# EAGLE design Puzzle PIR motion sensor v1.0 (EAGLE 5.10)
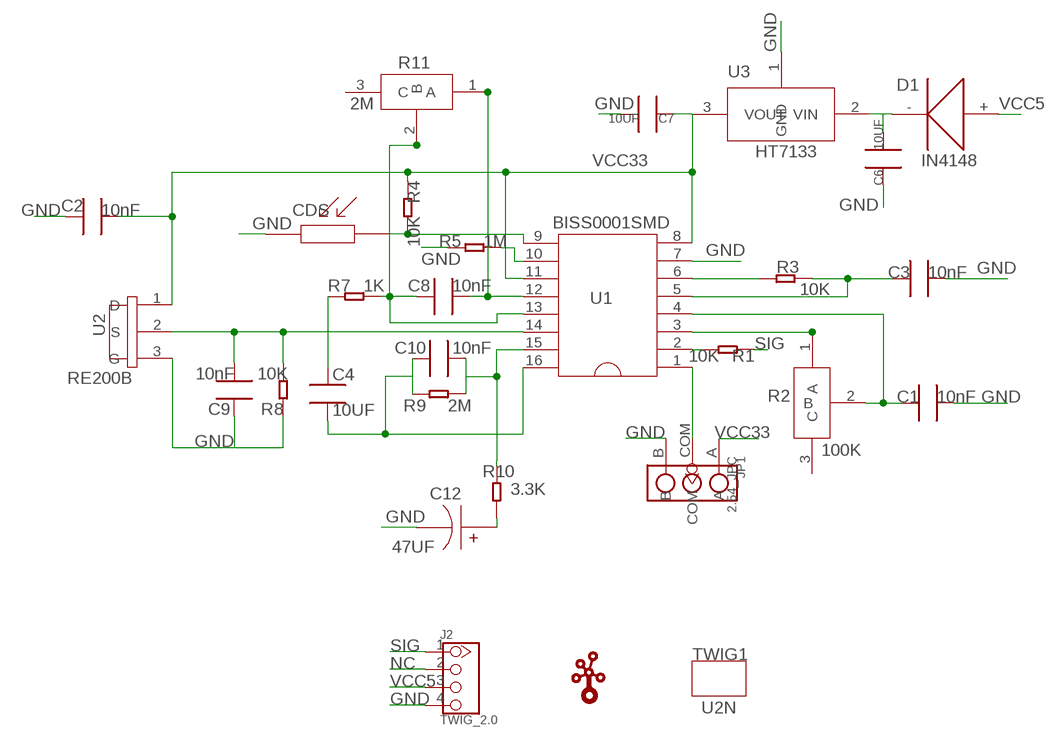
[diagram p0: schematic, sheet 1]

## Parts
C1  10nF  C0603  [0603]
C2  10nF  C0603  [0603]
C3  10nF  C0603  [0603]
C4  10UF  C0805  [0805]
C6  10UF  C0805  [0805]
C7  10UF  C0805  [0805]
C8  10nF  C0603  [0603]
C9  10nF  C0603  [0603]
C10  10nF  C0603  [0603]
C12  47UF  C_TAN1206  [C_TAN1206]
CDS  CDS  [CDS]
D1  IN4148  DIODE1206  [DIODE1206]
J2  TWIG_2.0  [2.0_1X4]
JP1  2.54_JPC  [2.54_JP_C]
R1  10K  R0603  [0603]
R2  100K  R_REG  [R_REG]
R3  10K  R0603  [0603]
R4  10K  R0603  [0603]
R5  1M  R0603  [0603]
R7  1K  R0603  [0603]
R8  10K  R0603  [0603]
R9  2M  R0603  [0603]
R10  3.3K  R0603  [0603]
R11  2M  R_REG  [R_REG]
TWIG1  U2N  [U2N]
U1  BISS0001SMD  [SOP16]
U2  RE200B  [RE200B]
U3  HT7133  [SOT89]
U$1  TWIGLOGOTWIGLOGO_SMALL  [TWIGLOGO_SMALL]

## Nets
GND: C1.2 C2.1 C3.2 C6.1 C7.2 C9.1 C12.2 CDS.1 J2.4 JP1.B R5.1 R8.1 U1.7 U2.3(G) U3.1(GND)
N$1: R2.1(A) U1.3
N$2: C1.1 R2.2(B) U1.4
N$3: C6.2 D1.- U3.2(VIN)
N$4: JP1.COM U1.1
N$5: R1.2 U1.2
N$6: R3.2 U1.6
N$7: C3.1 R3.1 U1.5
N$8: CDS.2 R4.2 U1.9
N$9: R5.2 U1.10
N$10: C9.2 R8.2 U1.14 U2.2(S)
N$11: C8.2 R11.1(A) U1.12
N$12: C8.1 R7.2 R11.2(B) U1.13
N$13: C4.2 C10.1 R9.1 U1.16
N$14: C10.2 R9.2 R10.2 U1.15
N$15: C4.1 R7.1
N$17: C12.1 R10.1
NC: J2.2
SIG: J2.1 R1.1
VCC5: D1.+ J2.3
VCC33: C2.2 C7.1 JP1.A R4.1 U1.8 U1.11 U2.1(D) U3.3(VOUT)
Unconnected: R2.3(C) R11.3(C)

## Library data of the parts
C1-C3 C8-C10 = CPT_SMD:C0603; C0603: 100N
C4 C6 C7 = CPT_SMD:C0805
C12 = seeedleo:C_TAN1206
CDS = seeedleo:CDS
D1 = CPT_SMD:DIODE
J2 = CONNECTER:TWIG_2.0
JP1 = CPT_CJ:2.54_JP
R1 R3-R5 R7-R10 = CPT_SMD:R0603
R2 R11 = seeedleo:R_REG
TWIG1 = twig_template1:U2N
U1 = seeedleo:BISS0001SMD
U2 = seeedleo:RE200B
U3 = seeedleo:HT7133
U$1 = seeedleo:TWIGLOGO

## Board
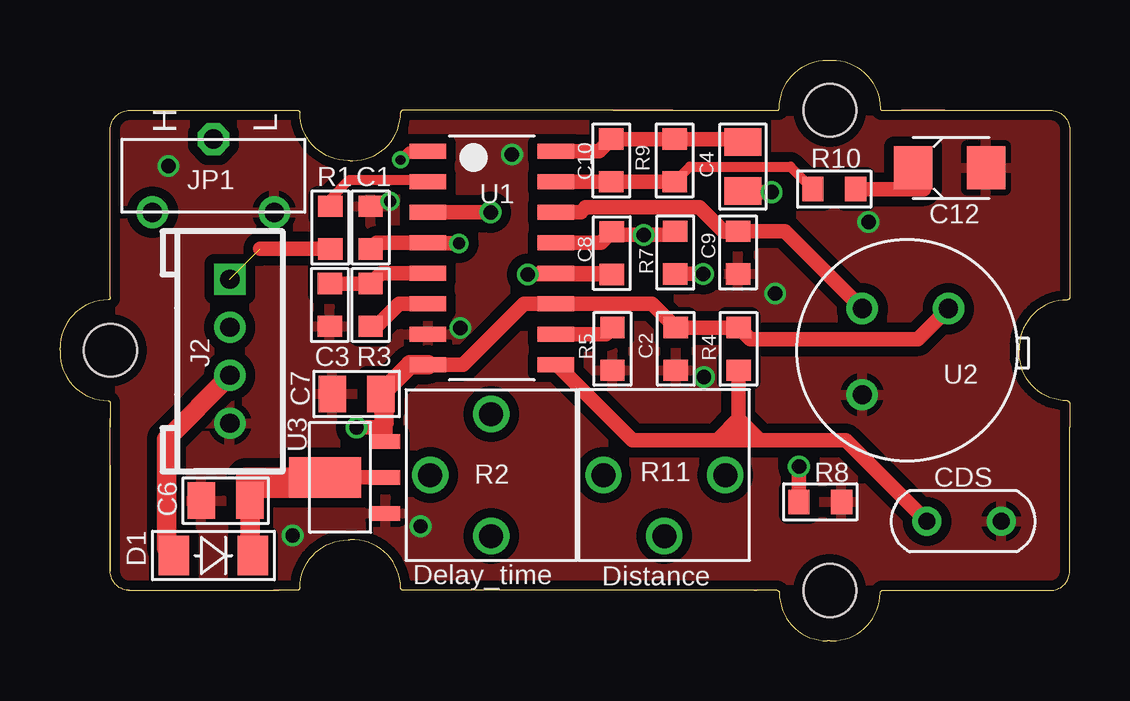
[diagram p1: board, top side]
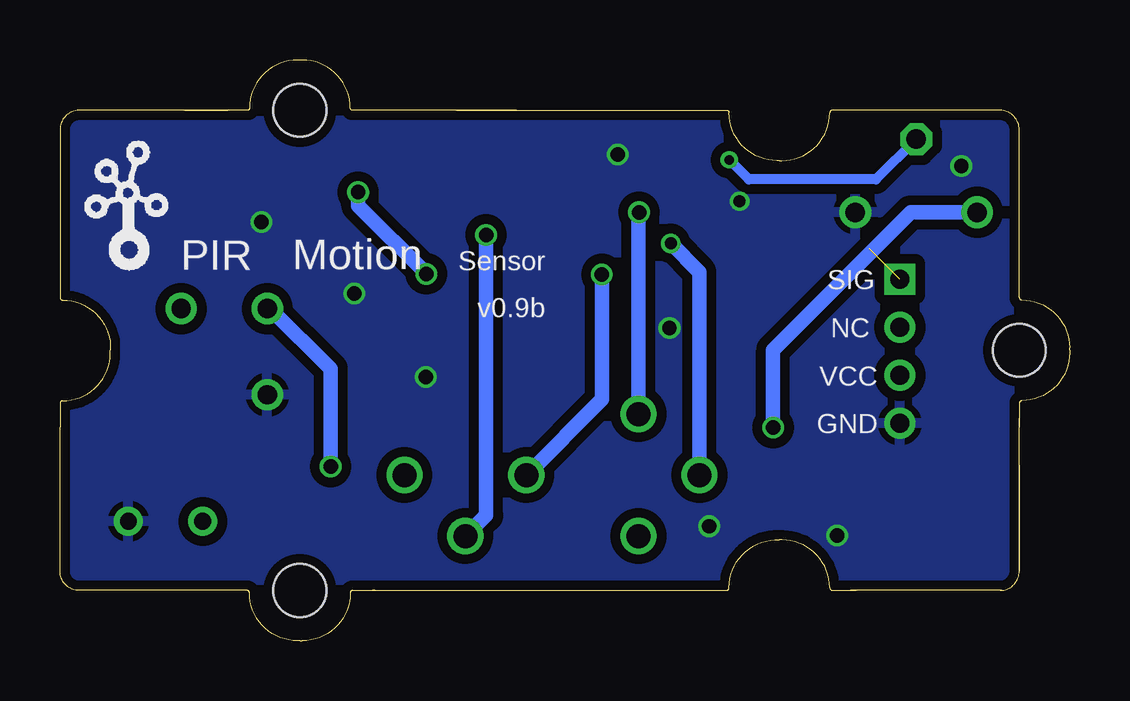
[diagram p2: board, bottom side, seen from below]

Size 42.09 x 24.2 mm. Coordinates in mm from the lower left corner, seen from the top.
Copper layers (1*16): Top 0.035mm / dielectric 1.5mm / Bottom 0.035mm
Design rules "SeeedStudio_rule_no_angle_090911": minimum track width 6mil, minimum drill 12mil, track to track 6mil, track to pad 6mil, pad to pad 6mil, via to via 6mil, smd to smd 0mil, copper to edge 10mil, drill to drill 10mil, minimum pad ring 10mil, minimum via ring 6mil, stop-mask expansion 2mil, vias tented up to drill 100mil, thermal gap 10mil

### Footprints (pad centres in the part's own frame; a part is rotated, then mirrored left to right if it is on the bottom)
0603 = smd 0.889 x 1.016: 1 -0.889,0; 2 0.889,0
0805 = smd 1.143 x 1.524: 1 -1.016,0; 2 1.016,0
C_TAN1206 = smd 1.6 x 1.8: 1 -1.27,0; 2 1.778,0
CDS = drill 0.7 round: 1 0,0; 2 3.1,0
DIODE1206 = smd 1.27 x 1.651: + -1.651,0; - 1.651,0
2.0_1X4 = drill 0.8 pad 1.27 square: 1 -3,0 | drill 0.8 pad 1.27 round: 2 -1,0; 3 1,0; 4 3,0
2.54_JP_C = drill 0.813 round: A -1.27,2.54; B -1.27,-2.54 | drill 0.813 octagon: COM 1.778,0
R_REG = drill 1 round: 1 0,0; 2 2.54,-2.54; 3 5.08,0
U2N = hole 2.2: 10.453,-10.42; 10.453,9.58; -19.535,-0.415
SOP16 = smd 0.635 x 1.524: 1 0,0; 2 1.27,0; 3 2.54,0; 4 3.81,0; 5 5.08,0; 6 6.35,0; 7 7.62,0; 8 8.89,0; 9 8.89,5.334; 10 7.62,5.334; 11 6.35,5.334; 12 5.08,5.334; 13 3.81,5.334; 14 2.54,5.334; 15 1.27,5.334; 16 0,5.334
RE200B = drill 0.8 round: 1 1.838,1.856; 2 -1.754,1.856; 3 -1.754,-1.736
SOT89 = smd 0.6 x 1.2: 1 -1.5,0; 2 0,0; 3 1.5,0 | smd 1.7 x 3: P$4 0,2.54

### Placement (x,y rotation side)
C1  12.95,17.22 90 top
C2  25.67,12.16 90 top
C3  11.25,13.99 270 top
C4  28.47,19.76 90 top
C6  6.9,5.84 0 top
C7  12.36,10.28 180 top
C8  23.01,16.15 270 top
C9  28.26,16.18 90 top
C10  22.98,20.01 270 top
C12  36.82,19.71 0 top
CDS  39.24,4.98 180 top
D1  6.4,3.55 0 top
J2  7.08,12.06 270 top
JP1  6.4,19.12 90 top
R1  11.27,17.22 90 top
R2  17.98,9.45 270 top
R3  12.95,13.99 270 top
R4  28.29,12.16 270 top
R5  23.03,12.16 90 top
R7  25.65,16.18 90 top
R8  31.69,5.79 180 top
R9  25.62,20.01 270 top
R10  32.28,18.82 180 top
R11  22.65,6.91 0 top
TWIG1  21.64,12.52 0 top
U1  15.34,20.39 270 top
U2  35.2,11.99 0 top
U3  13.58,6.8 90 top
U$1  41.45,15.31 0 bottom

### Tracks (layer width: path | path; a pad name or v marks a point on that pad's centre or on a via)
GND  (via drill 0.5, 0.6)
  Top 0.406: v13.76,18.31 13.15,18.31 C1.2
  other vias: 16.68,13.03 9.7,4.39 26.84,11 15.03,4.77 33.7,17.45 29.81,14.48 18.84,20.27 4.52,19.78
  pour Bottom (isolate 0.406): -1.48,24.84 43.99,24.84 43.99,-1.07 -1.48,-1.07
  pour Top (isolate 0.406): -1.48,24.84 44.11,24.84 44.11,-1.32 -1.48,-1.32
N$1  (via drill 0.6)
  Top 0.61: v17.95,17.85 U1.3
  Bottom 0.61: R2.1 17.98,17.83 v17.95,17.85
N$2  (via drill 0.5)
  Top 0.61: 13.1,16.18 C1.1 13.2,16.58 U1.4 15.36,16.56 v16.63,16.56
  Bottom 0.61: R2.2 15.44,15.37 v16.63,16.56
N$3
  Top 0.61: 10.87,6.81 U3.2
  Top 0.813: D1.- 7.92,3.55 C6.2 7.74,6.02 7.74,6.81 10.87,6.81
N$4  (via drill 0.41)
  Top 0.406: U1.1 14.55,20.39 v14.19,20.04
  Bottom 0.406: v14.19,20.04 13.38,19.23 8.07,19.23 JP1.COM
N$5
  Top 0.406: R1.2 11.27,18.41 12.06,19.2 15.26,19.2 U1.2
N$6
  Top 0.61: U1.6 14.14,14.04 13.2,13.1 R3.2
N$7
  Top 0.61: C3.1 R3.1 13.38,15.31 U1.5
N$8
  Top 0.61: U1.9 20.87,11.5 20.87,11.35 23.87,8.35 28.44,8.35 | 28.29,9.24 27.43,8.38 | 28.29,9.24 29.15,8.38 | 28.44,8.35 32.76,8.35 CDS.2 | 28.29,9.24 28.29,8.51 28.44,8.35 | 28.29,9.24 R4.2
N$9
  Top 0.61: U1.10 22.75,12.77 R5.2
N$10  (via drill 0.6)
  Top 0.61: R8.2 v30.8,7.26 | U1.14 21.71,17.85 21.91,18.06 26.66,18.06 27.68,17.04 28.21,17.04 C9.2 30.22,17.07 U2.2
  Bottom 0.61: U2.2 33.32,13.84 30.8,11.33 v30.8,7.26
N$11  (via drill 0.6)
  Top 0.61: U1.12 22.96,15.31 C8.2 v19.5,15.26
  Bottom 0.61: v19.5,15.26 19.5,10.06 R11.1
N$12  (via drill 0.6)
  Top 0.61: R7.2 25.5,16.91 v24.33,16.91 23.13,16.91 C8.1 22.55,16.58 U1.13
  Bottom 0.61: v24.33,16.91 24.33,5.23 R11.2
N$13
  Top 0.61: C4.2 28.37,20.9 R9.1 C10.1 22.47,20.39 U1.16
N$14
  Top 0.406: R9.2 26.26,19.76 30.45,19.76 R10.2
  Top 0.61: U1.15 C10.2 R9.2
N$15  (via drill 0.6)
  Top 0.61: 25.67,15.26 R7.1 v26.82,15.29 | v29.66,18.69 28.52,18.69 C4.1
  Bottom 0.61: v29.66,18.69 29.66,18.13 v26.82,15.29
N$17
  Top 0.61: 35.73,19.23 35.71,19.2 | 35.73,19.23 35.73,19.53 C12.1 | R10.1 36.01,18.82 36.01,18.95 35.73,19.23
SIG  (1 unrouted)
  Top 0.61: R1.1 8.35,16.33
VCC5
  Top 0.61: 4.57,3.55 D1.+
  Top 0.813: J2.3 7.08,11.05 4.44,8.41 4.44,3.86 D1.+
VCC33  (via drill 0.6)
  Top 0.61: 16.07,11.5 U1.8 16.81,11.5 19.35,14.04 U1.11 24.68,14.04 C2.2 R4.1 28.77,12.57 35.76,12.57 U2.1 | 13.51,10.16 C7.1 | v12.36,8.89 13.28,8.89 13.51,9.12 13.58,9.12 U3.3
  Top 0.813: 13.51,9.12 13.51,10.16 | U1.8 14.6,11.5 C7.1
  Bottom 0.61: JP1.A 6.62,17.85 12.36,12.11 v12.36,8.89
(copper drawn outside any net)
  shapes: Top area x1

### Text on the board
tPlace: H | L | Delay_time | Distance
bPlace: Motion | PIR | Sensor | SIG | v0.9b | NC | VCC | GND